# Altium schematic sheet RTU_LMG_ORing3V3.SchDoc
size A4; SheetNumber: 10; SheetTotal: 17
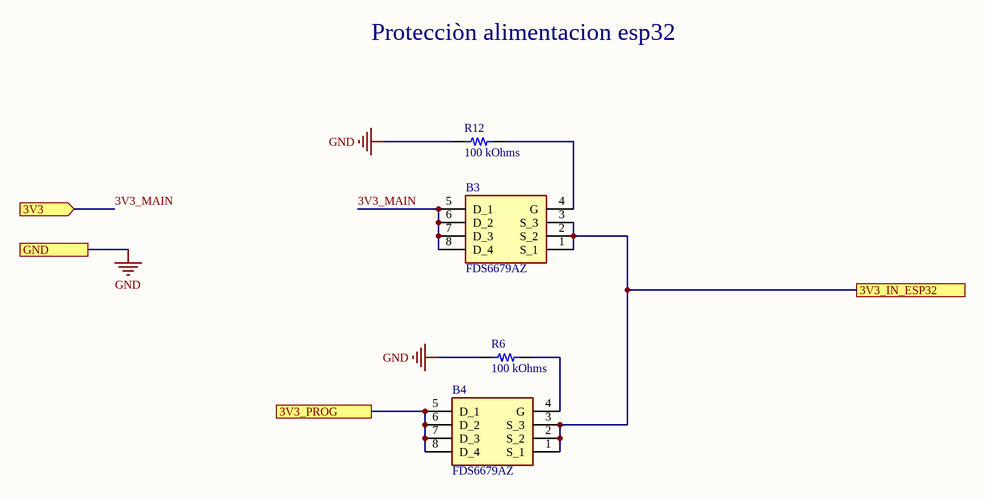
[diagram p0: RTU_LMG_ORing3V3.SchDoc]

## Parts
B3  FDS6679AZ  [SOIC127P600X175-8N]
B4  FDS6679AZ  [SOIC127P600X175-8N]
R6  100 kOhms  [RES 0603_1608]
R12  100 kOhms  [RES 0603_1608]

## Ports
3V3 (in), 3V3_IN_ESP32, 3V3_PROG, GND

## Nets
GND: R6.1 R12.1 ; port GND
3V3_IN_ESP32: B3.1(S_1) B3.2(S_2) B3.3(S_3) B4.1(S_1) B4.2(S_2) B4.3(S_3) ; port 3V3_IN_ESP32
3V3_MAIN: B3.5(D_1) B3.6(D_2) B3.7(D_3) B3.8(D_4) ; port 3V3
3V3_PROG: B4.5(D_1) B4.6(D_2) B4.7(D_3) B4.8(D_4) ; port 3V3_PROG
NetB3_4: B3.4(G) R12.2
NetB4_4: B4.4(G) R6.2

## Notes on the sheet
- Protecciòn alimentacion esp32

## Library data of the parts
B3 B4 = FDS6679AZ: Max rDS(on) = 14.8m at VGS = -4.5V, ID = -11A; HBM ESD protection level of 6kV typical (note 3); High power and current handing capability; Extended VGS range (-25V) for battery applications; High performance trench technology for extremely lowrDS(on); High power and current handing capability; Max rDS(on) = 9.3mat VGS = -10V, ID = -13A; Manufacturer_Name: onsemi; Geometry.Height: 1.75mm; Mouser Part Number: 512-FDS6679AZ; Mouser Price/Stock: https://www.mouser.co.uk/ProductDetail/onsemi-Fairchild/FDS6679AZ?qs=vnwGVgFuQiZlXnM8io%2FtYg%3D%3D; Manufacturer_Part_Number: FDS6679AZ; Datasheet Link: https://www.onsemi.com/pub/Collateral/FDS6679AZ-D.PDF
R6 R12 = RNCS0603BKE100K: RES 100K OHM 0.1% 1/16W 0603; Manufacturer: Stackpole Electronics Inc; Power (Watts): 0.063W, 1/16W; Temperature Coefficient: ±25ppm/°C; Part Number: RNCS0603BKE100K; Value: 100 kOhms; ComponentLink1Description: Datasheet; ComponentLink1URL: https://www.seielect.com/catalog/sei-rncs_rnch.pdf; ComponentLink2Description: DigiKey Link; ComponentLink2URL: https://www.digikey.com/en/products/detail/stackpole-electronics-inc/RNCS0603BKE100K/1708835; Composition: Thin Film; Device Package: 0603 (1608 Metric); Features: Anti-Corrosive, Automotive AEC-Q200, Moisture Resistant; Height - Seated (Max): 0.022" (0.55mm); LastUpdated: 9/2/2024 20:43:37; Lifecycle Status: Active; Minimum Order: 1; Number of Terminations: 2; Operating Temperature: -55°C ~ 155°C; Package / Case: 0603 (1608 Metric); Packaging: TapeAndReel; PartId: 4849; Part Status: Active; Price: 0.06; Ratings: AEC-Q200; Resistance: 100 kOhms; Series: RNCS; Size / Dimension: 0.061" L x 0.031" W (1.55mm x 0.80mm); Supplier 1: DigiKey; Supplier Part Number 1: RNCS0603BKE100KCT-ND; Supplier Device Package: 0603; Tolerance: ±0.1%